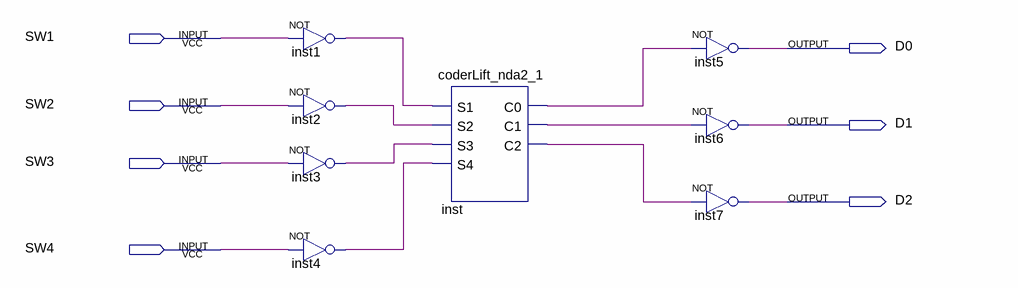
[diagram p0: schematic sheet]
// Quartus schematic coderLiftStend_nda2_1.bdf as structural Verilog: 8 symbols, 7 pins
module coderLiftStend_nda2_1 (
  input  SW1,
  input  SW2,
  input  SW3,
  input  SW4,
  output D0,
  output D1,
  output D2
);

  wire inst1_out, inst2_out, inst3_out, inst4_out, inst_c0, inst_c1, inst_c2;

  not inst1 (inst1_out, SW1);
  not inst2 (inst2_out, SW2);
  not inst3 (inst3_out, SW3);
  not inst4 (inst4_out, SW4);
  coderLift_nda2_1 inst (
    .S1(inst1_out), .S2(inst2_out), .S3(inst3_out), .S4(inst4_out), .C0(inst_c0), .C1(inst_c1), .C2(inst_c2));
  not inst5 (D0, inst_c0);
  not inst6 (D1, inst_c1);
  not inst7 (D2, inst_c2);
endmodule
